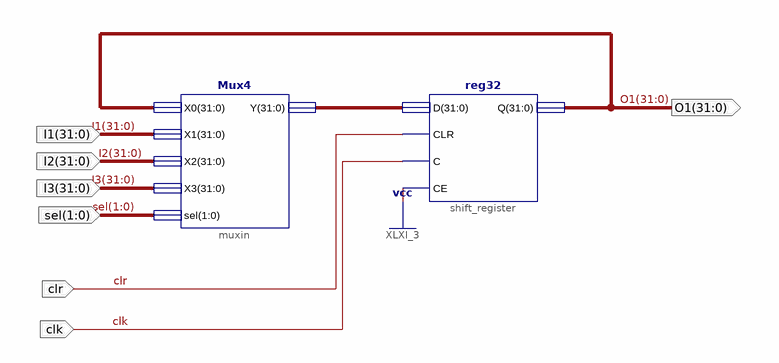
[diagram p0: schematic sheet 1]
// Xilinx ISE schematic netring.sch (spartan6) as structural Verilog: 2 symbols, 7 ports
module netring (
  input  [31:0] I1,
  input  [31:0] I2,
  input  [31:0] I3,
  input  [1:0] sel,
  input  clr,
  input  clk,
  output [31:0] O1
);

  wire [31:0] XLXN_1;

  reg32 shift_register (.D(XLXN_1), .CLR(clr), .C(clk), .CE(1'b1), .Q(O1));
  Mux4 muxin (.X0(O1), .X1(I1), .X2(I2), .X3(I3), .sel(sel), .Y(XLXN_1));
endmodule
